# Altium schematic sheet [1].ISO-RS485.SchDoc
size A
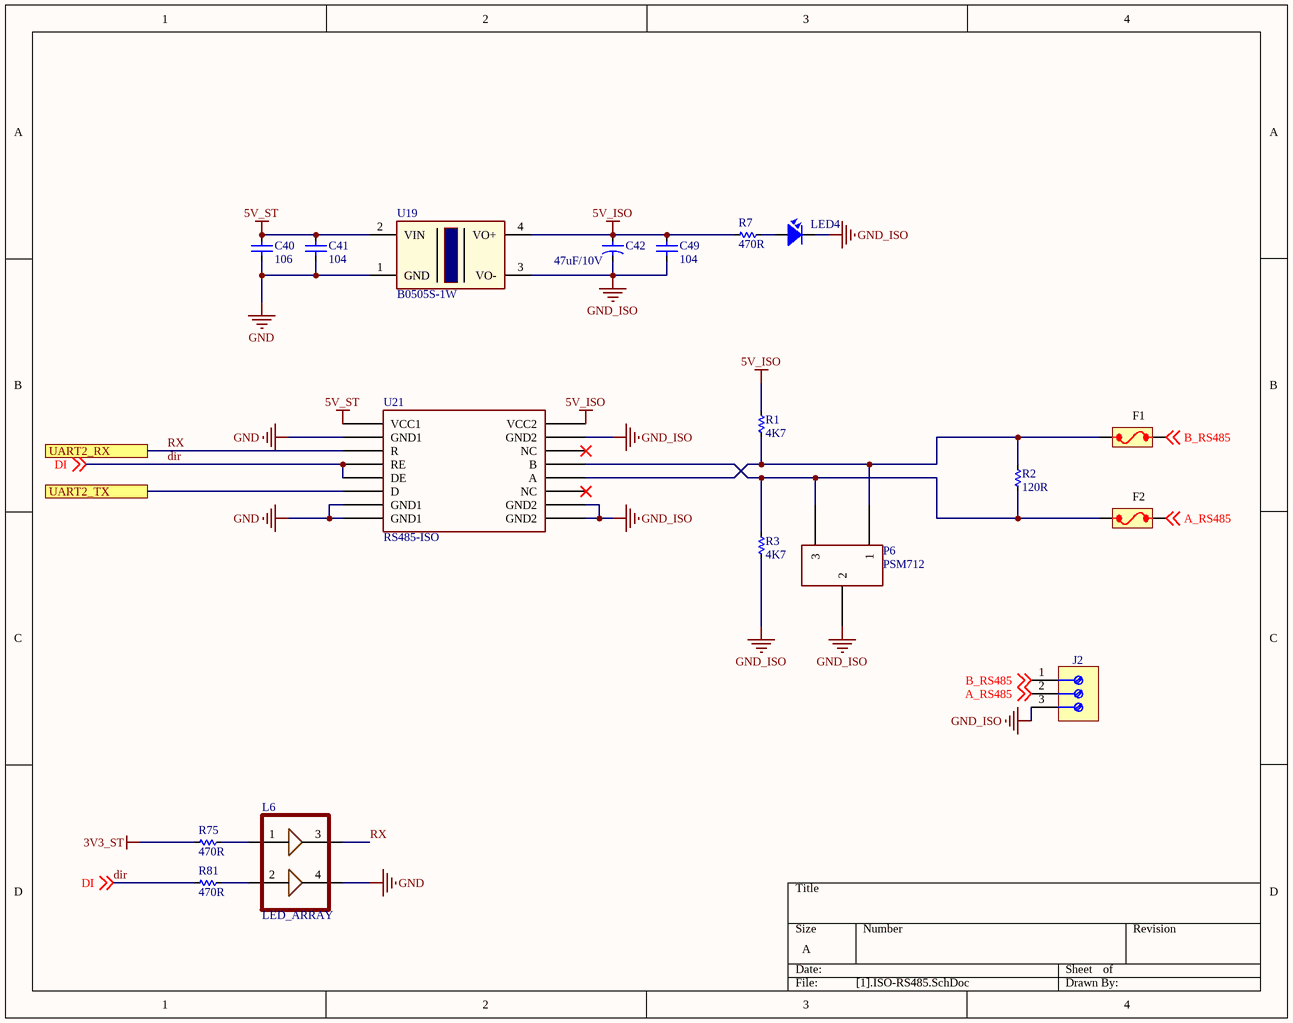
[diagram p0: [1].ISO-RS485.SchDoc]

## Parts
C40  106  [CAP-1206-SC]
C41  104  [CAP-1206-SC]
C42  47uF/10V  [CAP 6.3X12X2.5]
C49  104  [CAP-1206-SC]
F1  FUSE  [FUSE_RESETTABLE_SMD_1812]  (value not drawn)
F2  FUSE  [FUSE_RESETTABLE_SMD_1812]  (value not drawn)
J2  (no value)  [PHOENIX_1803439]
L6  LED_ARRAY  [LED_ARRAY2]
LED4  LED RED 3mm  [LED-3MM-RED]  (value not drawn)
P6  PSM712  [SOT23C]
R1  4K7  [RES-SMD-0805]
R2  120R  [RES-SMD-0805]
R3  4K7  [RES-SMD-0805]
R7  470R  [RES-SMD-0805]
R75  470R  [RES-SMD-0805]
R81  470R  [RES-SMD-0805]
U19  B0505S-1W  [B0505S_1W]
U21  RS485-ISO  [SOIC127P1030X265-16N]

## Ports
UART2_RX, UART2_TX

## Nets
3V3_ST: R75.2
5V_ISO: C42.1 C49.1 R1.2 R7.2 U19.4(VO+) U21.16(VCC2)
5V_ST: C40.1 C41.1 U19.2(VIN) U21.1(VCC1)
GND: C40.2 C41.2 L6.4 U19.1(GND) U21.2(GND1) U21.7(GND1) U21.8(GND1)
GND_ISO: C42.2 C49.2 J2.3 LED4.2 P6.2 R3.1 U19.3(VO-) U21.9(GND2) U21.10(GND2) U21.15(GND2)
A_RS485: F2.2 J2.2 ; off-sheet A_RS485
B_RS485: F1.2 J2.1 ; off-sheet B_RS485
dir: R81.2 U21.4(RE) U21.5(DE) ; off-sheet DI  [also labelled DI]
RX: L6.3 U21.3(R) ; port UART2_RX
UART2_TX: U21.6(D) ; port UART2_TX
NetF1_1: F1.1 P6.1 R1.1 R2.2 U21.12(A)
NetF2_1: F2.1 P6.3 R2.1 R3.2 U21.13(B)
NetL6_1: L6.1 R75.1
NetL6_2: L6.2 R81.1
NetLED4_1: LED4.1 R7.1

Not connected (* = marked no-connect by the designer): U21 11(NC)* 14(NC)*

## Library data of the parts
C40 C41 C49 = CAP_NP: Value: 0.1
C42 = CAP 100uF/16V
F1 F2 = FUSE: Value: Cau chi ong 30A; Vendor: Digikey; Published: 13-April-2009; Publisher: Hoang Nguyen; ComponentLink1Description: Digikey Part Link; ComponentLink2Description: Open Datasheet; ComponentLink2URL: H:\LIBRARY\LIBRARY.Datasheet\
J2 = Terminal Block_3 Positions_Screw Connection: Terminal Block, 3 Positions, Screw Connection
LED4 = LED: LED Single colour Green and Red; Value: LED 3 ly Single Colour
R1-R3 R7 R75 R81 = Res-SMD: Resistor; Manufacturer: Generic Components; Class: Passive; Published: 08/06/2000; Publisher: Altium Hobart Technology Centre
U19 = B0505S-1W: MH_PN: MH003143; Value: B0505S-1W